# Altium schematic sheet ultrasonic_rx.SchDoc: Opo
size Letter; Author: William Huang; Engineer: William Huang; Revision: 3.0
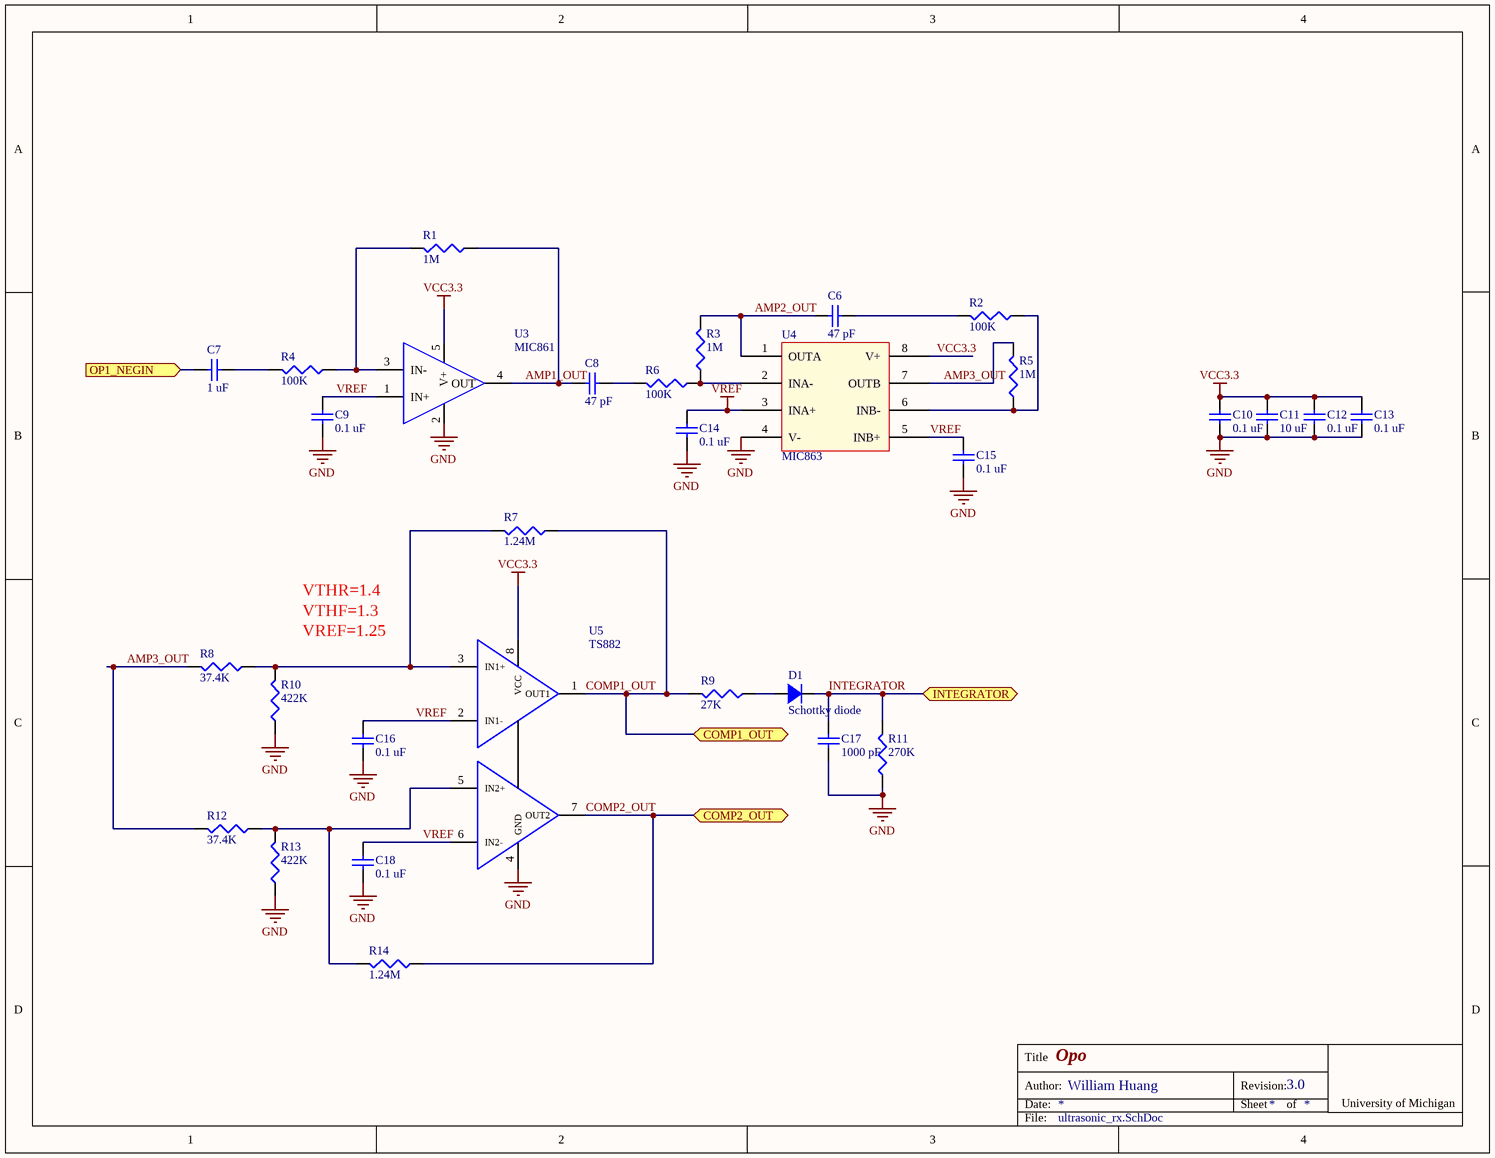
[diagram p0: ultrasonic_rx.SchDoc]

## Parts
C6  value 47 pF  [0402]  (hidden comment: Ceramic capacitor)
C7  value 1 uF  [0402]  (hidden comment: Ceramic capacitor)
C8  value 47 pF  [0402]  (hidden comment: Ceramic capacitor)
C9  value 0.1 uF  [0402]  (hidden comment: Ceramic capacitor)
C10  value 0.1 uF  [0402]  (hidden comment: Ceramic capacitor)
C11  value 10 uF  [0603]  (hidden comment: Ceramic capacitor)
C12  value 0.1 uF  [0402]  (hidden comment: Ceramic capacitor)
C13  value 0.1 uF  [0402]  (hidden comment: Ceramic capacitor)
C14  value 0.1 uF  [0402]  (hidden comment: Ceramic capacitor)
C15  value 0.1 uF  [0402]  (hidden comment: Ceramic capacitor)
C16  value 0.1 uF  [0402]  (hidden comment: Ceramic capacitor)
C17  value 1000 pF  [0402]  (hidden comment: Ceramic capacitor)
C18  value 0.1 uF  [0402]  (hidden comment: Ceramic capacitor)
D1  Schottky diode  [0603 - DIODE]
R1  value 1M  [0402]  (hidden comment: Chip resistor)
R2  value 100K  [0402]  (hidden comment: Chip resistor)
R3  value 1M  [0402]  (hidden comment: Chip resistor)
R4  value 100K  [0402]  (hidden comment: Chip resistor)
R5  value 1M  [0402]  (hidden comment: Chip resistor)
R6  value 100K  [0402]  (hidden comment: Chip resistor)
R7  value 1.24M  [0402]  (hidden comment: Chip resistor)
R8  value 37.4K  [0402]  (hidden comment: Chip resistor)
R9  value 27K  [0402]  (hidden comment: Chip resistor)
R10  value 422K  [0402]  (hidden comment: Chip resistor)
R11  value 270K  [0402]  (hidden comment: Chip resistor)
R12  value 37.4K  [0402]  (hidden comment: Chip resistor)
R13  value 422K  [0402]  (hidden comment: Chip resistor)
R14  value 1.24M  [0402]  (hidden comment: Chip resistor)
U3  MIC861  [SC70-5]
U4  MIC863  [TSOP65P280X145-8N]
U5  TS882  [SO8]

## Ports
COMP1_OUT, COMP2_OUT, INTEGRATOR, OP1_NEGIN (in)

## Nets
GND: C9.2 C10.2 C11.2 C12.2 C13.2 C14.2 C15.2 C16.2 C17.2 C18.2 R10.2 R11.2 R13.2 U3.2(V-) U4.4(V-) U5.4(GND)
VCC3.3: C10.1 C11.1 C12.1 C13.1 U3.5(V+) U4.8(V+) U5.8(VCC)
VREF: C9.1 C14.1 C15.1 C16.1 C18.1 U3.1(IN+) U4.3(INA+) U4.5(INB+) U5.2(IN1-) U5.6(IN2-)
AMP1_OUT: C8.1 R1.2 U3.4(OUT)
AMP2_OUT: C6.1 R3.1 U4.1(OUTA)
AMP3_OUT: R5.1 R8.1 R12.1 U4.7(OUTB)
COMP1_OUT: R7.2 R9.1 U5.1(OUT1) ; port COMP1_OUT
COMP2_OUT: R14.2 U5.7(OUT2) ; port COMP2_OUT
INTEGRATOR: C17.1 D1.2 R11.1 ; port INTEGRATOR
OP1_NEGIN: C7.1 ; port OP1_NEGIN
NetC6_2: C6.2 R2.1
NetC7_2: C7.2 R4.1
NetC8_2: C8.2 R6.1
NetD1_1: D1.1 R9.2
NetR1_1: R1.1 R4.2 U3.3(IN-)
NetR2_2: R2.2 R5.2 U4.6(INB-)
NetR3_2: R3.2 R6.2 U4.2(INA-)
NetR7_1: R7.1 R8.2 R10.1 U5.3(IN1+)
NetR12_2: R12.2 R13.1 R14.1 U5.5(IN2+)

## Notes on the sheet
- VTHR=1.4
- VTHF=1.3
- VREF=1.25
- Title
- Date:
- Author:
- Revision:
- Sheet
- of
- University of Michigan
- File:

## Library data of the parts
C6 C8 = C_47p_0402_ceramic: Ceramic capacitor, 47 pF, 0402 package; Manufacture: Johanson; voltage rated: 50 V; tolerance: 5%; package: 0402; Supplier 1: Digi-Key; Supplier Part Number 1: 709-1121-1-ND
C7 = C_1u_0402_ceramic: Ceramic capacitor, 1 uF, 0402 package; Manufacture: TDK; voltage rated: 6.3 V; tolerance: 10%; package: 0402; Supplier 1: Digi-Key; Supplier Part Number 1: 445-5000-1-ND
C9 C10 C12-C16 C18 = C_0.1u_0402_ceramic: Ceramic capacitor, 0.1u, 0402 package; Manufacture: TDK; voltage rated: 10 V; tolerance: 10%; Supplier 1: Digi-Key; Supplier Part Number 1: 445-1265-1-ND; package: 0402
C11 = C_10u_0603_ceramic: Ceramic capacitor, 10 uF, 0603 package; Manufacture: TDK; voltage rated: 6.3V; tolerance: 20%; package: 0603; Supplier 1: Digi-Key; Supplier Part Number 1: 445-4112-1-ND
C17 = C_1000p_0402_ceramic: Ceramic capacitor, 1000 pF, 0402 package; Manufacture: TDK; voltage rated: 50 V; tolerance: 10%; package: 0402; Supplier 1: Digi-Key; Supplier Part Number 1: 445-6846-1-ND
D1 = D_SCHOTTKY_30V_0.1A_0603: Schottky diode 30 V 0.1 A 0603; package: 0603; Supplier 1: Digi-Key; Supplier Part Number 1: 641-1282-1-ND
R1 R3 R5 = R_1M_0402: Chip resistor, 1M, 0402 package; tolerance: 1%; power: 1/16 W; Supplier 1: Digi-Key; package: 0402; Supplier Part Number 1: 541-1.00MLCT-ND
R2 R4 R6 = R_100K_0402: Chip resistor, 100K, 0402 package; tolerance: 1%; power: 1/16 W; Supplier 1: Digi-Key; Supplier Part Number 1: 541-100KLCT-ND; package: 0402
R7 R14 = R_1.24M_0402: Chip resistor, 1.24M, 0402 package; tolerance: 1%; power: 1/16 W; package: 0402; Supplier 1: Digi-Key; Supplier Part Number 1: 541-1.24MLCT-ND
R8 R12 = R_37.4K_0402: Chip resistor, 37.4K, 0402 package; tolerance: 1%; power: 1/16 W; package: 0402; Supplier 1: Digi-Key; Supplier Part Number 1: 541-37.4KLCT-ND
R9 = R_27K_0402: Chip resistor, 27K, 0402 package; tolerance: 1%; power: 1/16 W; package: 0402; Supplier 1: Digi-Key; Supplier Part Number 1: 541-27.0KLCT-ND
R10 R13 = R_422K_0402: Chip resistor, 422K, 0402 package; tolerance: 1%; power: 1/16 W; package: 0402; Supplier 1: Digi-Key; Supplier Part Number 1: 541-422KLCT-ND
R11 = R_270K_0402: Chip resistor, 270K, 0402 package; tolerance: 1%; power: 1/16 W; package: 0402; Supplier 1: Digi-Key; Supplier Part Number 1: 541-270KLCT-ND
U3 = MIC861: IC OPAMP 400KHZ 2.7V ULT LP SC70; Supplier 1: Digi-Key; Supplier Part Number 1: 576-2932-1-ND
U4 = MIC863: Dual Ultra Low Power Op Amp in SOT23-8; Supplier 1: Digi-Key; Supplier Part Number 1: 576-2934-1-ND
U5 = TS882: Ultra Low Power Dual Comparator; Supplier 1: Digikey; Supplier 2: Digikey; Supplier 2 Part Number: 497-13800-1-ND; Supplier Part Number 1: 497-14073-1-ND